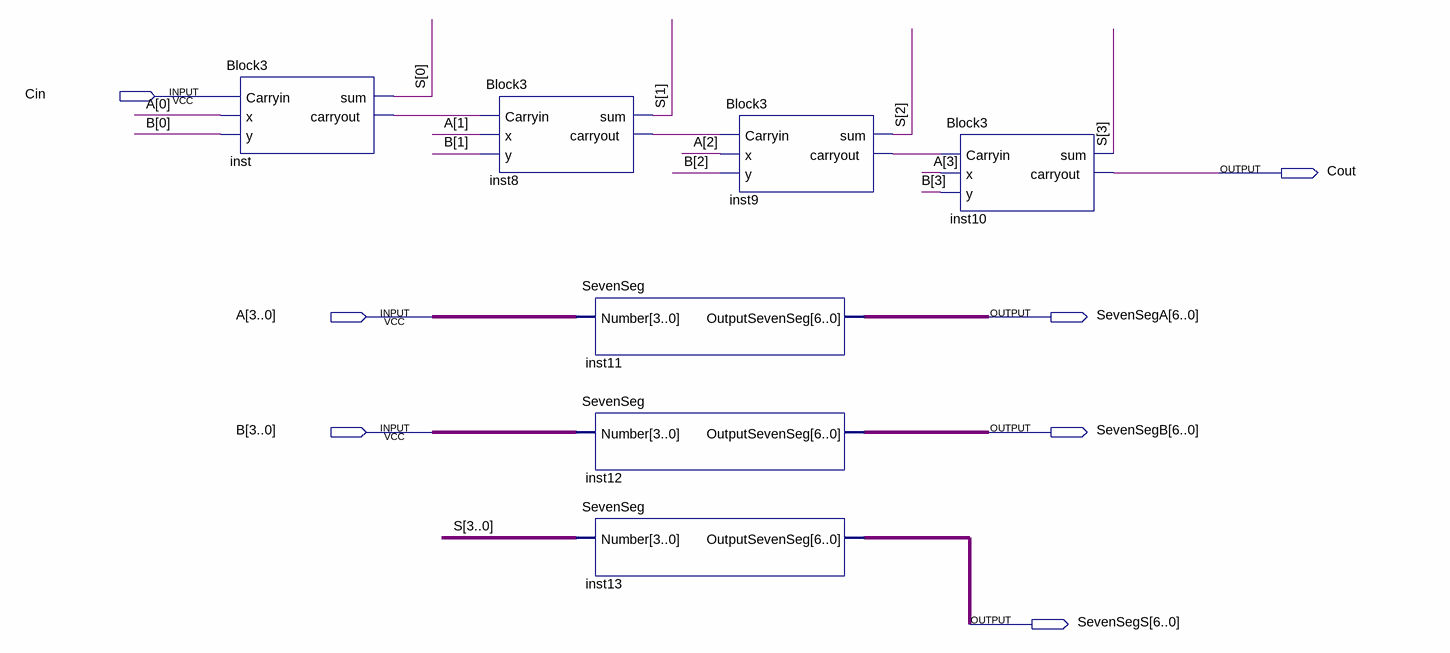
[diagram p0: schematic sheet]
// Quartus schematic Block4.bdf as structural Verilog: 7 symbols, 7 pins
module Block4 (
  input  Cin,
  input  [3:0] A,
  input  [3:0] B,
  output Cout,
  output [6:0] SevenSegA,
  output [6:0] SevenSegB,
  output [6:0] SevenSegS
);

  wire inst8_carryout, inst9_carryout, inst_carryout;
  wire [3:0] S;

  Block3 inst (.Carryin(Cin), .x(A[0]), .y(B[0]), .sum(S[0]), .carryout(inst_carryout));
  Block3 inst8 (.Carryin(inst_carryout), .x(A[1]), .y(B[1]), .sum(S[1]), .carryout(inst8_carryout));
  SevenSeg inst11 (.Number(A), .OutputSevenSeg(SevenSegA));
  SevenSeg inst12 (.Number(B), .OutputSevenSeg(SevenSegB));
  SevenSeg inst13 (.Number(S), .OutputSevenSeg(SevenSegS));
  Block3 inst9 (.Carryin(inst8_carryout), .x(A[2]), .y(B[2]), .sum(S[2]), .carryout(inst9_carryout));
  Block3 inst10 (.Carryin(inst9_carryout), .x(A[3]), .y(B[3]), .sum(S[3]), .carryout(Cout));
endmodule
